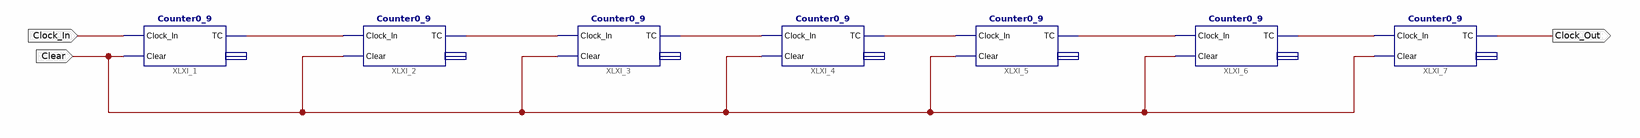
[diagram p0: schematic sheet 1]
// Xilinx ISE schematic Div10M.sch (spartan6) as structural Verilog: 7 symbols, 3 ports
module Div10M (
  input  Clock_In,
  input  Clear,
  output Clock_Out
);

  wire XLXN_1, XLXN_2, XLXN_3, XLXN_4, XLXN_5, XLXN_6;

  Counter0_9 XLXI_1 (.Clock_In(Clock_In), .Clear(Clear), .TC(XLXN_1));  // open: Count
  Counter0_9 XLXI_2 (.Clock_In(XLXN_1), .Clear(Clear), .TC(XLXN_2));  // open: Count
  Counter0_9 XLXI_3 (.Clock_In(XLXN_2), .Clear(Clear), .TC(XLXN_3));  // open: Count
  Counter0_9 XLXI_4 (.Clock_In(XLXN_3), .Clear(Clear), .TC(XLXN_4));  // open: Count
  Counter0_9 XLXI_5 (.Clock_In(XLXN_4), .Clear(Clear), .TC(XLXN_5));  // open: Count
  Counter0_9 XLXI_6 (.Clock_In(XLXN_5), .Clear(Clear), .TC(XLXN_6));  // open: Count
  Counter0_9 XLXI_7 (.Clock_In(XLXN_6), .Clear(Clear), .TC(Clock_Out));  // open: Count
endmodule
